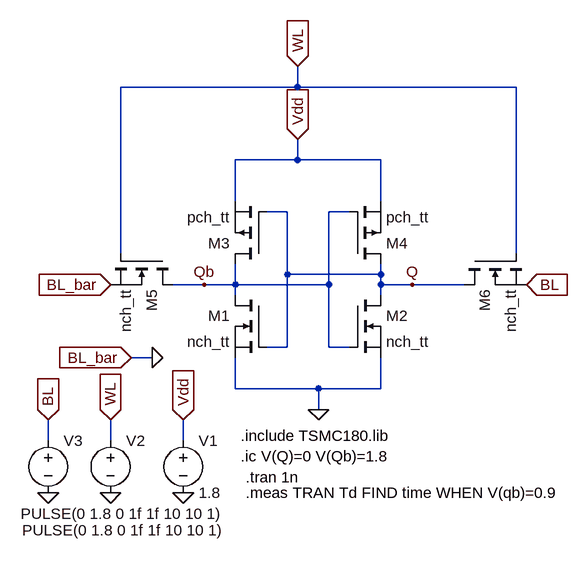
[diagram p0: schematic Prob_1b.asc]
Prob_1b.asc, the LTspice schematic file:
Version 4
SHEET 1 880 680
WIRE 128 -112 128 -144
WIRE 128 -112 -144 -112
WIRE 464 -112 128 -112
WIRE 128 0 128 -32
WIRE 128 0 32 0
WIRE 256 0 128 0
WIRE 32 64 32 0
WIRE 256 64 256 0
WIRE 112 80 80 80
WIRE 208 80 176 80
WIRE -144 144 -144 -112
WIRE 464 144 464 -112
WIRE 112 176 112 80
WIRE 256 176 256 160
WIRE 256 176 112 176
WIRE -16 192 -64 192
WIRE 32 192 32 160
WIRE 32 192 -16 192
WIRE 176 192 176 80
WIRE 176 192 32 192
WIRE 256 192 256 176
WIRE 304 192 256 192
WIRE 384 192 304 192
WIRE 32 208 32 192
WIRE 256 208 256 192
WIRE 112 288 112 176
WIRE 112 288 80 288
WIRE 176 288 176 192
WIRE 208 288 176 288
WIRE -96 304 -128 304
WIRE 32 352 32 304
WIRE 160 352 32 352
WIRE 256 352 256 304
WIRE 256 352 160 352
WIRE 160 384 160 352
WIRE -256 432 -256 400
WIRE -160 432 -160 400
WIRE -48 432 -48 400
FLAG 160 384 0
FLAG -48 512 0
FLAG -48 400 Vdd
IOPIN -48 400 In
FLAG 128 -32 Vdd
IOPIN 128 -32 In
FLAG 128 -144 WL
IOPIN 128 -144 In
FLAG -160 192 BL_bar
IOPIN -160 192 In
FLAG 480 192 BL
IOPIN 480 192 In
FLAG -16 192 Qb
FLAG 304 192 Q
FLAG -160 512 0
FLAG -160 400 WL
IOPIN -160 400 In
FLAG -256 512 0
FLAG -256 400 BL
IOPIN -256 400 In
FLAG -128 304 BL_bar
IOPIN -128 304 In
FLAG -96 304 0
SYMBOL nmos 80 208 M0
SYMATTR InstName M1
SYMATTR Value nch_tt
SYMATTR Value2 W=720n,L=180n
SYMBOL nmos 208 208 R0
SYMATTR InstName M2
SYMATTR Value nch_tt
SYMATTR Value2 W=720n,L=180n
SYMBOL pmos 80 160 R180
SYMATTR InstName M3
SYMATTR Value pch_tt
SYMATTR Value2 W=270n,L=270n
SYMBOL pmos 208 160 M180
SYMATTR InstName M4
SYMATTR Value pch_tt
SYMATTR Value2 W=270n,L=270n
SYMBOL nmos -64 144 R90
SYMATTR InstName M5
SYMATTR Value nch_tt
SYMATTR Value2 W=360n,L=180n
SYMBOL nmos 384 144 M90
SYMATTR InstName M6
SYMATTR Value nch_tt
SYMATTR Value2 W=360n,L=180n
SYMBOL voltage -48 416 R0
WINDOW 123 0 0 Left 0
WINDOW 39 0 0 Left 0
SYMATTR InstName V1
SYMATTR Value 1.8
SYMBOL voltage -160 416 R0
WINDOW 3 -136 154 Left 2
WINDOW 123 0 0 Left 0
WINDOW 39 0 0 Left 0
SYMATTR Value PULSE(0 1.8 0 1f 1f 10 10 1)
SYMATTR InstName V2
SYMBOL voltage -256 416 R0
WINDOW 3 -42 128 Left 2
WINDOW 123 0 0 Left 0
WINDOW 39 0 0 Left 0
SYMATTR InstName V3
SYMATTR Value PULSE(0 1.8 0 1f 1f 10 10 1)
TEXT 40 424 Left 2 !.include TSMC180.lib
TEXT 40 456 Left 2 !.ic V(Q)=0 V(Qb)=1.8
TEXT 48 488 Left 2 !.tran 1n
TEXT 48 512 Left 2 !.meas TRAN Td FIND time WHEN V(qb)=0.9

The netlist it stands for:
* Prob_1b.asc
M1 Qb Q 0 0 nch_tt W=720n,L=180n
M2 Q Qb 0 0 nch_tt W=720n,L=180n
M3 Qb Q Vdd Vdd pch_tt W=270n,L=270n
M4 Q Qb Vdd Vdd pch_tt W=270n,L=270n
M5 Qb WL 0 0 nch_tt W=360n,L=180n
M6 Q WL BL BL nch_tt W=360n,L=180n
V1 Vdd 0 1.8
V2 WL 0 PULSE(0 1.8 0 1f 1f 10 10 1)
V3 BL 0 PULSE(0 1.8 0 1f 1f 10 10 1)
.model NMOS NMOS
.model PMOS PMOS
.lib standard.mos
.include TSMC180.lib
.ic V(Q)=0 V(Qb)=1.8
.tran 1n
.meas TRAN Td FIND time WHEN V(qb)=0.9
.backanno
.end

* Results of the author's LTspice run, read from the files saved beside the schematic
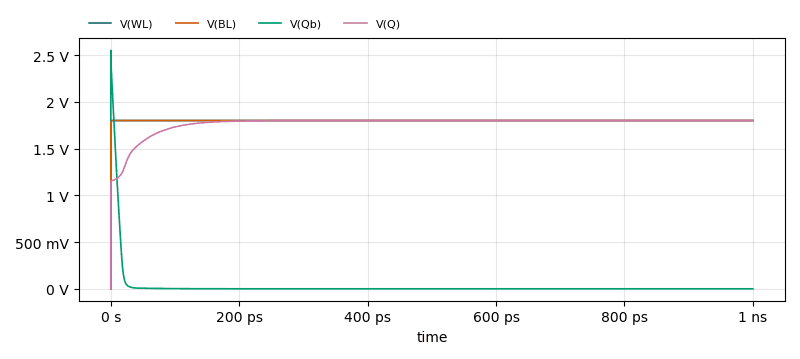
[diagram p1: Transient Analysis of Prob_1b.asc, plotted from the saved traces]
* Transient Analysis, 1 run:
*   V(WL): min 0 V, max 1.8 V, average 1.8 V, rms 1.8 V, last 1.8 V
*   V(BL): min 0 V, max 1.8 V, average 1.8 V, rms 1.8 V, last 1.8 V
*   V(Qb): min 0 V, max 2.551 V, average 24.37 mV, rms 192.7 mV, last 0 V
*   V(Q): min 0 V, max 1.8 V, average 1.769 V, rms 1.772 V, last 1.8 V
* From the log:
*   td: time=1.18647e-011 at 1.18647e-011